# Altium project NewDriver.PrjPCB
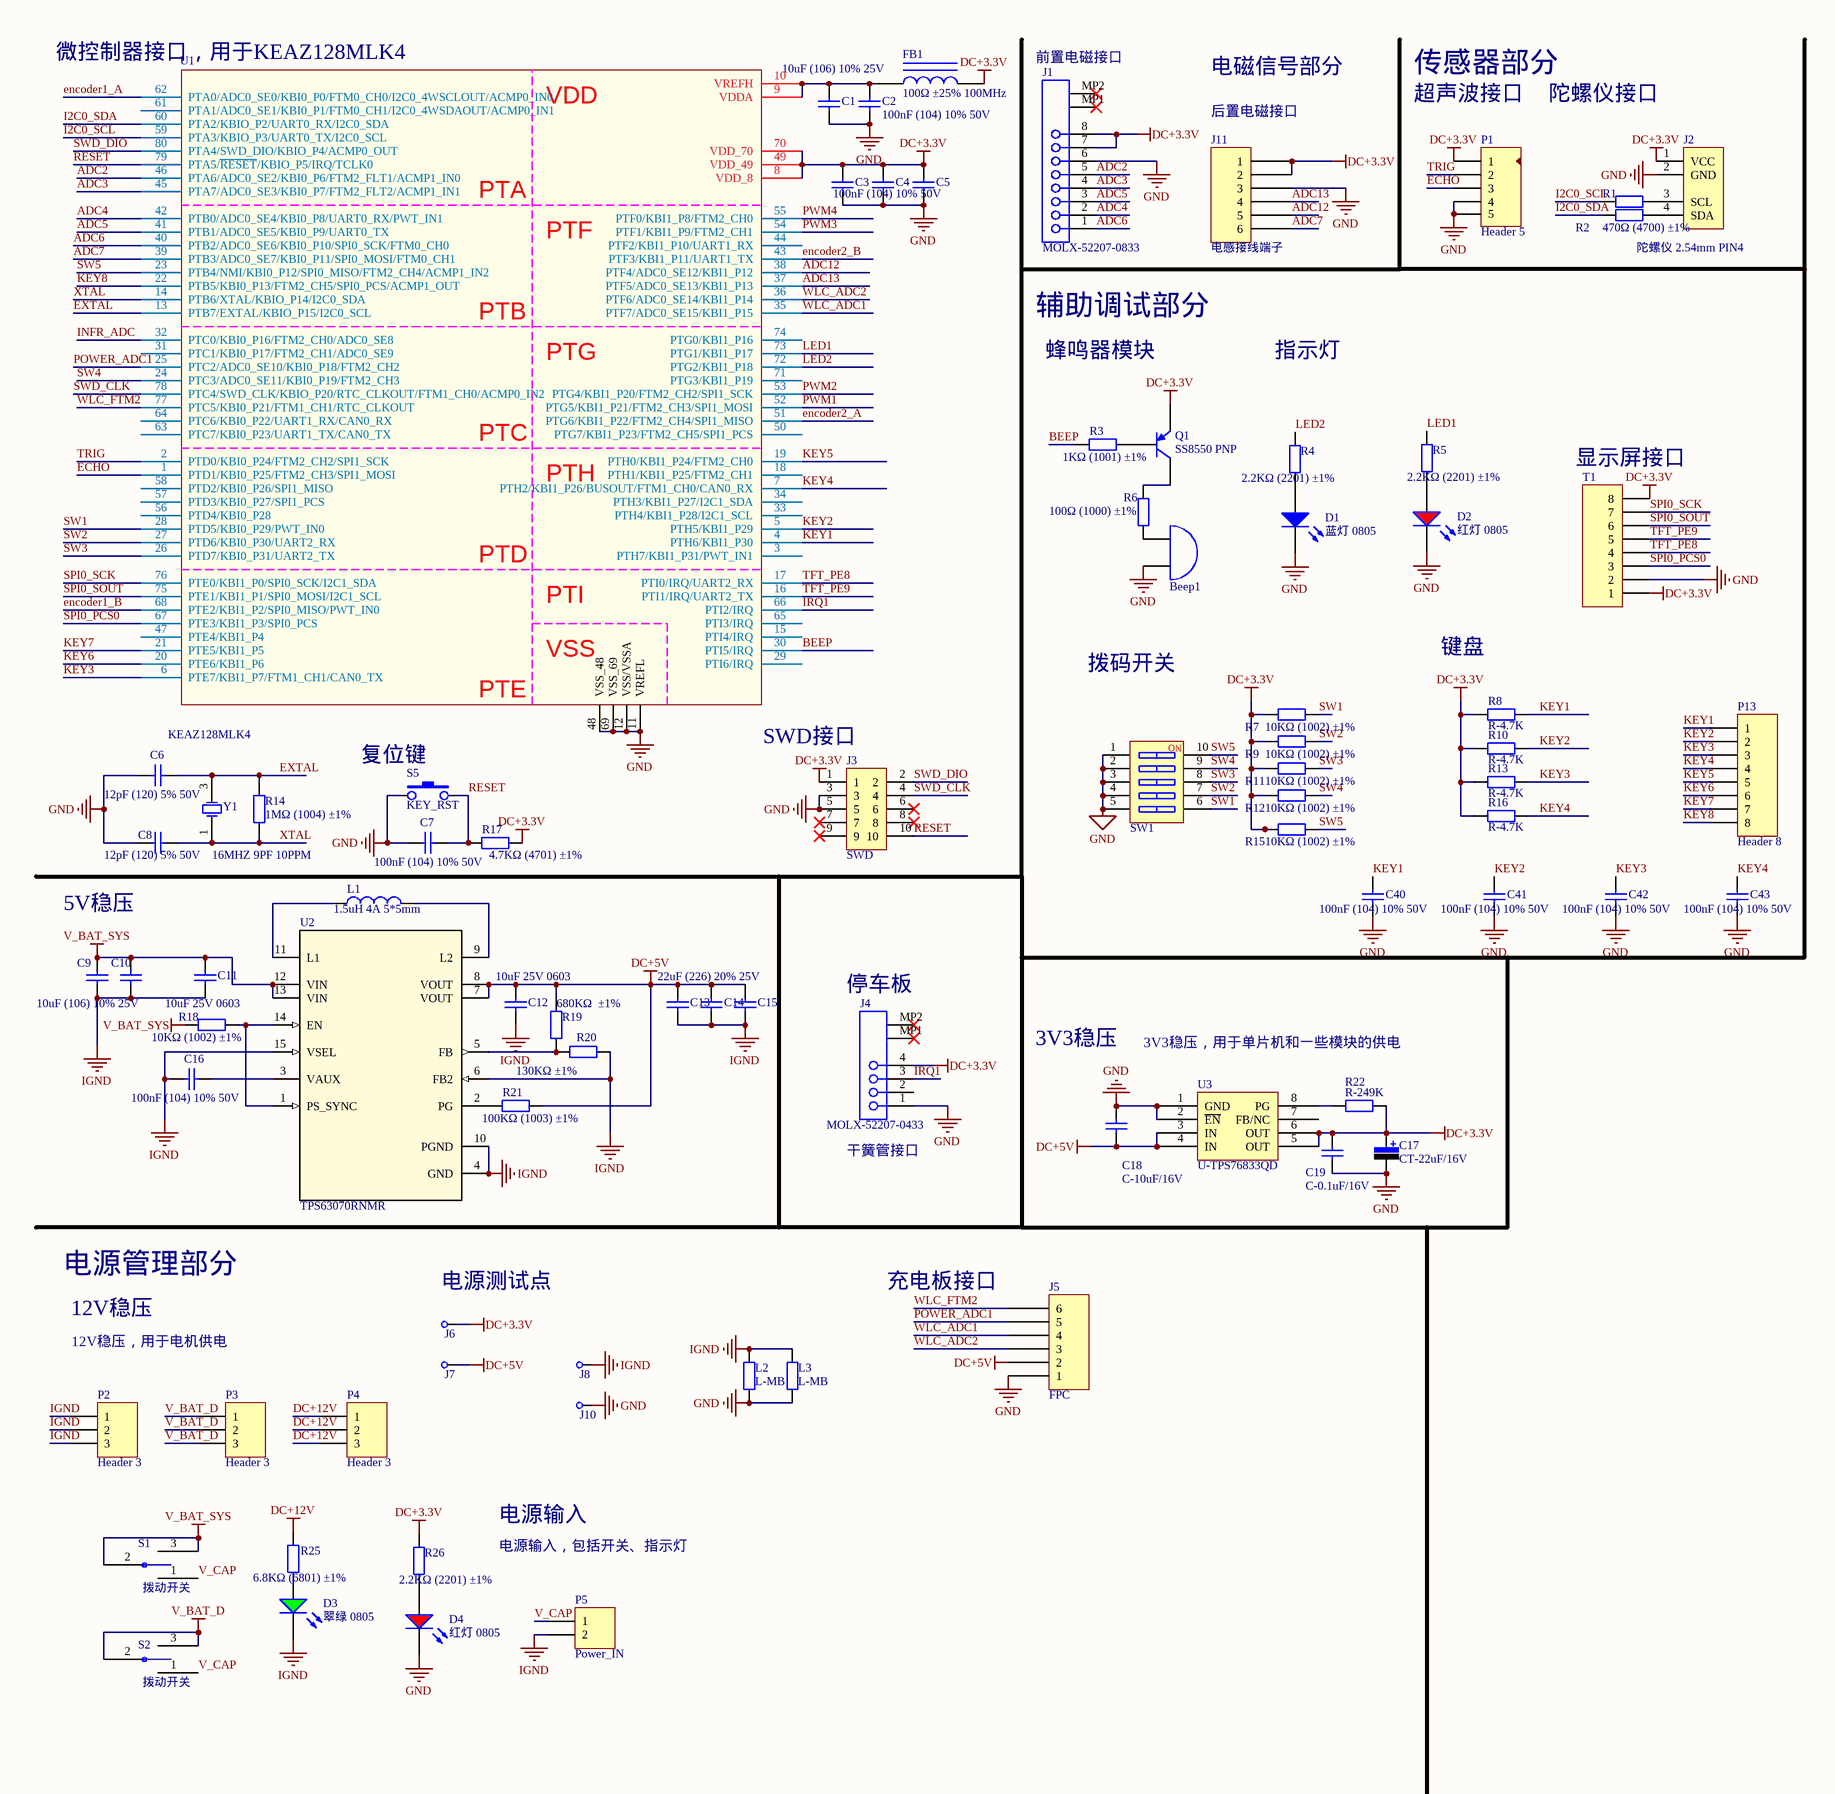
[diagram p0: thelast.SchDoc, left]
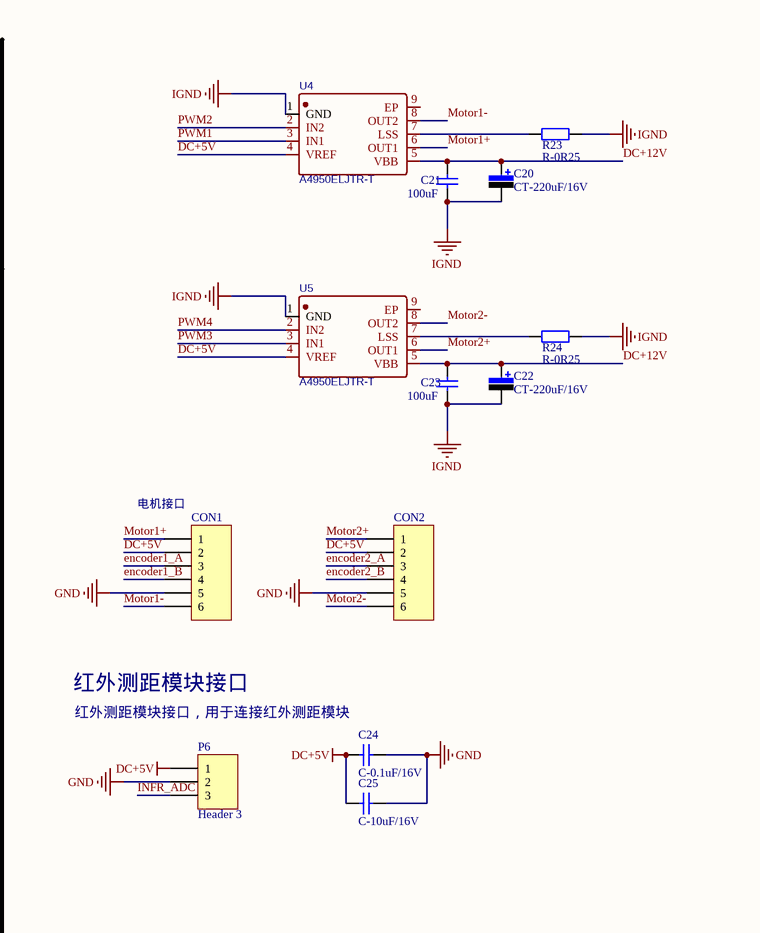
[diagram p1: thelast.SchDoc, right]
1 sheet, 95 parts. Net scope: global (net labels, ports and power ports of the same name join across sheets).
Board file: NewDriver.PcbDoc

## Sheet thelast.SchDoc
size A2

### Parts
Beep1  蜂鸣器  [beep]  (value not drawn)
C1  10uF (106) 10% 25V  [0603_C]
C2  100nF (104) 10% 50V  [0603_C]
C3  100nF (104) 10% 50V  [0603-1]
C4  100nF (104) 10% 50V  [0603-1]  (value not drawn)
C5  100nF (104) 10% 50V  [0603-1]  (value not drawn)
C6  12pF (120) 5% 50V  [0603-1]
C7  100nF (104) 10% 50V  [0603-1]
C8  12pF (120) 5% 50V  [0603-1]
C9  10uF (106) 10% 25V  [0805_C]
C10  10uF (106) 10% 25V  [0805_C]  (value not drawn)
C11  10uF 25V 0603  [0603_C]
C12  10uF 25V 0603  [0603_C]
C13  22uF (226) 20% 25V  [0805_C]  (value not drawn)
C14  22uF (226) 20% 25V  [0805_C]  (value not drawn)
C15  22uF (226) 20% 25V  [0805_C]
C16  100nF (104) 10% 50V  [0603_C]
C17  CT-22uF/16V  [CAP-3528]
C18  C-10uF/16V  [0603-1]
C19  C-0.1uF/16V  [0603-1]
C20  CT-220uF/16V  [CASE-E_7343]
C21  100uF  [0603-1]
C22  CT-220uF/16V  [CASE-E_7343]
C23  100uF  [0603-1]
C24  C-0.1uF/16V  [0603-1]
C25  C-10uF/16V  [0603-1]
C40  100nF (104) 10% 50V  [0603-1]
C41  100nF (104) 10% 50V  [0603-1]
C42  100nF (104) 10% 50V  [0603-1]
C43  100nF (104) 10% 50V  [0603-1]
CON1  Header 6  [HDR1X6]  (value not drawn)
CON2  Header 6  [HDR1X6]  (value not drawn)
D1  蓝灯 0805  [0603_R]
D2  红灯 0805  [0603_R]
D3  翠绿 0805  [0603_R]
D4  红灯 0805  [0603_R]
FB1  100Ω ±25% 100MHz  [0805-1]
J1  MOLX-52207-0833  [FPC-SMD_8PIN-PITCH1.00-BR_LW10251-08]
J2  陀螺仪 2.54mm PIN4  [2.54排针1X4]
J3  SWD  [2.54排针2X5]
J4  MOLX-52207-0433  [MOLX-52207-0433]
J5  FPC  [FPC6P]
J6  CHECK  [CHECK-A]  (value not drawn)
J7  CHECK  [CHECK-A]  (value not drawn)
J8  CHECK  [CHECK-A]  (value not drawn)
J10  CHECK  [CHECK-A]  (value not drawn)
J11  电感接线端子  [FPC6P]
L1  1.5uH 4A 5*5mm  [Inductor_1.5uH]
L2  L-MB  [0603-1]
L3  L-MB  [0603-1]
P1  Header 5  [HDR5X1-2.54]
P2  Header 3  [HDR1X3]
P3  Header 3  [HDR1X3]
P4  Header 3  [HDR1X3]
P5  Power_IN  [电源接口]
P6  Header 3  [HDR1X3]
P13  Header 8  [HDR1X8]
Q1  SS8550 PNP  [SOT-23Q]
R1  470Ω (4700) ±1%  [0603_R]  (value not drawn)
R2  470Ω (4700) ±1%  [0603_R]
R3  1KΩ (1001) ±1%  [0603_R]
R4  2.2KΩ (2201) ±1%  [0603_R]
R5  2.2KΩ (2201) ±1%  [0603_R]
R6  100Ω (1000) ±1%  [0603_R]
R7  10KΩ (1002) ±1%  [0603_R]
R8  R-4.7K  [0603-1]
R9  10KΩ (1002) ±1%  [0603_R]
R10  R-4.7K  [0603-1]
R11  10KΩ (1002) ±1%  [0603_R]
R12  10KΩ (1002) ±1%  [0603_R]
R13  R-4.7K  [0603-1]
R14  1MΩ (1004) ±1%  [0603_R]
R15  10KΩ (1002) ±1%  [0603_R]
R16  R-4.7K  [0603-1]
R17  4.7KΩ (4701) ±1%  [0603_R]
R18  10KΩ (1002) ±1%  [0603_R]
R19  680KΩ  ±1%  [0603_R]
R20  130KΩ ±1%  [0603_R]
R21  100KΩ (1003) ±1%  [0603_R]
R22  R-249K  [0603-1]
R23  R-0R25  [2512]
R24  R-0R25  [2512]
R25  6.8KΩ (6801) ±1%  [0603_R]
R26  2.2KΩ (2201) ±1%  [0603_R]
S1  拨动开关  [SW-TO3]
S2  拨动开关  [SW-TO3]
S5  KEY_RST  [KEY-K2]
SW1  5P  [拨码开关DIP-5P]  (value not drawn)
T1  Header 8  [HDR1X8]  (value not drawn)
U1  KEAZ128MLK4  [LQFP80(KEA)]
U2  TPS63070RNMR  [RNM0015A]
U3  U-TPS76833QD  [SOIC-8-r]
U4  A4950ELJTR-T  [SOIC-8_EP_150MIL]
U5  A4950ELJTR-T  [SOIC-8_EP_150MIL]
Y1  16MHZ 9PF 10PPM  [SMD-3225_4P]

### Nets
DC+3.3V: C3.2 C4.2 C5.2 C17.1 C19.2 FB1.2 J1.7 J1.8 J2.1(VCC) J3.1 J4.4 J6.1 J11.1 J11.2 P1.1 Q1.E R7.1 R8.1 R9.1 R10.1 R11.1 R12.1 R13.1 R15.1 R16.1 R17.1 R22.2 R26.2 T1.1 T1.8 U1.8(VDD_8) U1.49(VDD_49) U1.70(VDD_70) U3.5(OUT) U3.6(OUT)
DC+5V: C12.1 C13.2 C14.2 C15.2 C18.1 C24.1 C25.2 CON1.2 CON2.2 J5.2 J7.1 P6.1 R19.2 R21.2 U2.7(VOUT) U2.8(VOUT) U3.3(IN) U3.4(IN) U4.4(VREF) U5.4(VREF)
DC+12V: C20.1 C21.2 C22.1 C23.2 P4.1 P4.2 P4.3 R25.2 U4.5(VBB) U5.5(VBB)
GND: Beep1.2(B) C1.1 C2.1 C3.1 C4.1 C5.1 C6.1 C7.1 C8.1 C17.2 C18.2 C19.1 C24.2 C25.1 C40.2 C41.2 C42.2 C43.2 CON1.5 CON2.5 D1.K D2.K D4.K J1.6 J2.2(GND) J3.3 J3.5 J4.1 J5.1 J10.1 J11.3 L2.1 L3.1 P1.4 P1.5 P6.2 S5.1 SW1.1 SW1.2 SW1.3 SW1.4 SW1.5 T1.2 U1.11(VREFL) U1.12(VSS/VSSA) U1.48(VSS_48) U1.69(VSS_69) U3.1(GND) U3.2(~{EN})
IGND: C9.1 C10.1 C11.1 C12.2 C13.1 C14.1 C15.1 C16.1 C20.2 C21.1 C22.2 C23.1 D3.K J8.1 L2.2 L3.2 P2.1 P2.2 P2.3 P5.2 R20.1 R23.1 R24.1 U2.4(GND) U2.6(FB2) U2.10(PGND) U2.15(VSEL) U4.1(GND) U5.1(GND)
V_BAT_D: P3.1 P3.2 P3.3 S2.2 S2.3
V_BAT_SYS: C9.2 C10.2 C11.2 R18.2 S1.2 S1.3 U2.12(VIN) U2.13(VIN)
ADC2: J1.5 U1.46(PTA6/ADC0_SE2/KBI0_P6/FTM2_FLT1/ACMP1_IN0)
ADC3: J1.4 U1.45(PTA7/ADC0_SE3/KBI0_P7/FTM2_FLT2/ACMP1_IN1)
ADC4: J1.2 U1.42(PTB0/ADC0_SE4/KBI0_P8/UART0_RX/PWT_IN1)
ADC5: J1.3 U1.41(PTB1/ADC0_SE5/KBI0_P9/UART0_TX)
ADC6: J1.1 U1.40(PTB2/ADC0_SE6/KBI0_P10/SPI0_SCK/FTM0_CH0)
ADC7: J11.6 U1.39(PTB3/ADC0_SE7/KBI0_P11/SPI0_MOSI/FTM0_CH1)
ADC12: J11.5 U1.38(PTF4/ADC0_SE12/KBI1_P12)
ADC13: J11.4 U1.37(PTF5/ADC0_SE13/KBI1_P13)
BEEP: R3.1 U1.30(PTI5/IRQ)
ECHO: P1.3 U1.1(PTD1/KBI0_P25/FTM2_CH3/SPI1_MOSI)
encoder1_A: CON1.3 U1.62(PTA0/ADC0_SE0/KBI0_P0/FTM0_CH0/I2C0_4WSCLOUT/ACMP0_IN0)
encoder1_B: CON1.4 U1.68(PTE2/KBI1_P2/SPI0_MISO/PWT_IN0)
encoder2_A: CON2.3 U1.51(PTG6/KBI1_P22/FTM2_CH4/SPI1_MISO)
encoder2_B: CON2.4 U1.43(PTF3/KBI1_P11/UART1_TX)
EXTAL: C6.2 R14.2 U1.13(PTB7/EXTAL/KBIO_P15/I2C0_SCL) Y1.3(OSC2)
I2C0_SCL: R1.1 U1.59(PTA3/KBIO_P3/UART0_TX/I2C0_SCL)
I2C0_SDA: R2.1 U1.60(PTA2/KBIO_P2/UART0_RX/I2C0_SDA)
INFR_ADC: P6.3 U1.32(PTC0/KBI0_P16/FTM2_CH0/ADC0_SE8)
IRQ1: J4.3 U1.66(PTI2/IRQ)
KEY1: C40.1 P13.1 R8.2 U1.4(PTH6/KBI1_P30)
KEY2: C41.1 P13.2 R10.2 U1.5(PTH5/KBI1_P29)
KEY3: C42.1 P13.3 R13.2 U1.6(PTE7/KBI1_P7/FTM1_CH1/CAN0_TX)
KEY4: C43.1 P13.4 R16.2 U1.7(PTH2/KBI1_P26/BUSOUT/FTM1_CH0/CAN0_RX)
KEY5: P13.5 U1.19(PTH0/KBI1_P24/FTM2_CH0)
KEY6: P13.6 U1.20(PTE6/KBI1_P6)
KEY7: P13.7 U1.21(PTE5/KBI1_P5)
KEY8: P13.8 U1.22(PTB5/KBI0_P13/FTM2_CH5/SPI0_PCS/ACMP1_OUT)
LED1: R5.2 U1.73(PTG1/KBI1_P17)
LED2: R4.2 U1.72(PTG2/KBI1_P18)
Motor1+: CON1.1 U4.6(OUT1)
Motor1-: CON1.6 U4.8(OUT2)
Motor2+: CON2.1 U5.6(OUT1)
Motor2-: CON2.6 U5.8(OUT2)
POWER_ADC1: J5.5 U1.25(PTC2/ADC0_SE10/KBI0_P18/FTM2_CH2)
PWM1: U1.52(PTG5/KBI1_P21/FTM2_CH3/SPI1_MOSI) U4.3(IN1)
PWM2: U1.53(PTG4/KBI1_P20/FTM2_CH2/SPI1_SCK) U4.2(IN2)
PWM3: U1.54(PTF1/KBI1_P9/FTM2_CH1) U5.3(IN1)
PWM4: U1.55(PTF0/KBI1_P8/FTM2_CH0) U5.2(IN2)
RESET: C7.2 J3.10 R17.2 S5.2 U1.79(PTA5/~{RESET}/KBIO_P5/IRQ/TCLK0)
SPI0_PCS0: T1.3 U1.67(PTE3/KBI1_P3/SPI0_PCS)
SPI0_SCK: T1.7 U1.76(PTE0/KBI1_P0/SPI0_SCK/I2C1_SDA)
SPI0_SOUT: T1.6 U1.75(PTE1/KBI1_P1/SPI0_MOSI/I2C1_SCL)
SW1: R7.2 SW1.6 U1.28(PTD5/KBI0_P29/PWT_IN0)
SW2: R9.2 SW1.7 U1.27(PTD6/KBI0_P30/UART2_RX)
SW3: R11.2 SW1.8 U1.26(PTD7/KBI0_P31/UART2_TX)
SW4: R12.2 SW1.9 U1.24(PTC3/ADC0_SE11/KBI0_P19/FTM2_CH3)
SW5: R15.2 SW1.10 U1.23(PTB4/NMI/KBI0_P12/SPI0_MISO/FTM2_CH4/ACMP1_IN2)
SWD_CLK: J3.4 U1.78(PTC4/SWD_CLK/KBIO_P20/RTC_CLKOUT/FTM1_CH0/ACMP0_IN2)
SWD_DIO: J3.2 U1.80(PTA4/SWD_DIO/KBIO_P4/ACMP0_OUT)
TFT_PE8: T1.4 U1.17(PTI0/IRQ/UART2_RX)
TFT_PE9: T1.5 U1.16(PTI1/IRQ/UART2_TX)
TRIG: P1.2 U1.2(PTD0/KBI0_P24/FTM2_CH2/SPI1_SCK)
V_CAP: P5.1 S1.1 S2.1
WLC_ADC1: J5.4 U1.35(PTF7/ADC0_SE15/KBI1_P15)
WLC_ADC2: J5.3 U1.36(PTF6/ADC0_SE14/KBI1_P14)
WLC_FTM2: J5.6 U1.77(PTC5/KBI0_P21/FTM1_CH1/RTC_CLKOUT)
XTAL: C8.2 R14.1 U1.14(PTB6/XTAL/KBIO_P14/I2C0_SDA) Y1.1(OSC1)
NetBeep1_1: Beep1.1(A) R6.1
NetC1_2: C1.2 C2.2 FB1.1 U1.9(VDDA) U1.10(VREFH)
NetC16_2: C16.2 U2.3(VAUX)
NetD1_A: D1.A R4.1
NetD2_A: D2.A R5.1
NetD3_A: D3.A R25.1
NetD4_A: D4.A R26.1
NetJ2_3: J2.3(SCL) R1.2
NetJ2_4: J2.4(SDA) R2.2
NetL1_1: L1.1 U2.11(L1)
NetL1_2: L1.2 U2.9(L2)
NetQ1_B: Q1.B R3.2
NetQ1_C: Q1.C R6.2
NetR18_1: R18.1 U2.1(PS_SYNC) U2.14(EN)
NetR19_1: R19.1 R20.2 U2.5(FB)
NetR21_1: R21.1 U2.2(PG)
NetR22_1: R22.1 U3.8(PG)
NetR23_2: R23.2 U4.7(LSS)
NetR24_2: R24.2 U5.7(LSS)

Not connected (* = marked no-connect by the designer): J1 MP1* MP2*; J3 6* 7* 8* 9*; J4 2 MP1* MP2*; U1 3(PTH7/KBI1_P31/PWT_IN1) 15(PTI4/IRQ) 18(PTH1/KBI1_P25/FTM2_CH1) 29(PTI6/IRQ) 31(PTC1/KBI0_P17/FTM2_CH1/ADC0_SE9) 33(PTH4/KBI1_P28/I2C1_SCL) 34(PTH3/KBI1_P27/I2C1_SDA) 44(PTF2/KBI1_P10/UART1_RX) 47(PTE4/KBI1_P4) 50(PTG7/KBI1_P23/FTM2_CH5/SPI1_PCS) 56(PTD4/KBI0_P28) 57(PTD3/KBI0_P27/SPI1_PCS) 58(PTD2/KBI0_P26/SPI1_MISO) 61(PTA1/ADC0_SE1/KBI0_P1/FTM0_CH1/I2C0_4WSDAOUT/ACMP0_IN1) 63(PTC7/KBI0_P23/UART1_TX/CAN0_TX) 64(PTC6/KBI0_P22/UART1_RX/CAN0_RX) 65(PTI3/IRQ) 71(PTG3/KBI1_P19) 74(PTG0/KBI1_P16); U3 7(FB/NC); U4 9(EP); U5 9(EP)

### Notes on the sheet
- (near U1) 微控制器接口，用于KEAZ128MLK4
- (near J1) 前置电磁接口
- (near J11) 后置电磁接口
- 电磁信号部分
- 传感器部分
- 超声波接口
- 陀螺仪接口
- 辅助调试部分
- 蜂鸣器模块
- 指示灯
- (near T1) 显示屏接口
- (near CON1) 电机接口
- 键盘
- 拨码开关
- 红外测距模块接口
- (near P6) 红外测距模块接口，用于连接红外测距模块
- 复位键
- (near U1) SWD接口
- 5V稳压
- (near J4) 停车板
- 3V3稳压
- 3V3稳压，用于单片机和一些模块的供电
- (near J4) 干簧管接口
- 电源管理部分
- 12V稳压
- (near J6) 电源测试点
- 充电板接口
- 12V稳压，用于电机供电
- 电源输入
- 电源输入，包括开关、指示灯
- (in symbol KEAZ128MLK4) VDD; PTA; PTF; PTB; PTG; PTC; PTH; PTD; PTI; VSS; PTE
- (in symbol 拨码开关5P) NO

### Library data of the parts
C1 C9 C10 = 0805 10uF (106) 10% 25V: 贴片电容; ComponentLink1Description: 供应商链接; ComponentLink1URL: http://www.szlcsc.com/product/details_16532.html; Package: 0805; Supplier: LC; SuppliersPartNumber: C15850
C2-C5 C7 C16 C40-C43 = 0603 100nF (104) 10% 50V: 贴片电容; ComponentLink1Description: 供应商链接; ComponentLink1URL: http://www.szlcsc.com/product/details_15331.html; Package: 0603; Supplier: LC; SuppliersPartNumber: C14663
C6 C8 = 0603 12pF (120) 5% 50V: 贴片电容; ComponentLink1Description: 供应商链接; ComponentLink1URL: http://www.szlcsc.com/product/details_39506.html; Package: 0603; Supplier: LC; SuppliersPartNumber: C38523
C11 C12 = 0603 10uF (106) 10% 10V: 贴片电容; ComponentLink1Description: 供应商链接; ComponentLink1URL: http://www.szlcsc.com/product/details_20411.html; Package: 0603; Supplier: LC; SuppliersPartNumber: C19702
C13-C15 = 0805 22uF (226) 20% 25V: 贴片电容; ComponentLink1Description: 供应商链接; ComponentLink1URL: http://www.szlcsc.com/product/details_46786.html; Package: 0805; Supplier: LC; SuppliersPartNumber: C45783
C17 C20 C22 = Cap-Pol-A: 钽电容; Published: 8-Jun-2000; LatestRevisionDate: 17-Jul-2002; LatestRevisionNote: Re-released for DXP Platform.; PackageReference: RB7.6-15; Publisher: Altium Limited; Comment_1: Cap-Pol
C18 = Cap: Capacitor; Value: 0.1uF; Published: 8-Jun-2000; LatestRevisionDate: 17-Jul-2002; LatestRevisionNote: Re-released for DXP Platform.; PackageReference: RAD-0.3; Publisher: Altium Limited; PackageDescription: Radial Cap, Thru-Hole; 2 Leads; 0.3 in Pin Spacing
C19 C21 C23 = Cap: Capacitor; Value: 100nF; Published: 8-Jun-2000; LatestRevisionDate: 17-Jul-2002; LatestRevisionNote: Re-released for DXP Platform.; PackageReference: RAD-0.3; Publisher: Altium Limited; PackageDescription: Radial Cap, Thru-Hole; 2 Leads; 0.3 in Pin Spacing
C24 C25 = Cap: Capacitor; Value: 100pF; Published: 8-Jun-2000; LatestRevisionDate: 17-Jul-2002; LatestRevisionNote: Re-released for DXP Platform.; PackageReference: RAD-0.3; Publisher: Altium Limited; PackageDescription: Radial Cap, Thru-Hole; 2 Leads; 0.3 in Pin Spacing
CON1 CON2 = Header 6: Header, 6-Pin; LatestRevisionDate: 17-Jul-2002; LatestRevisionNote: Re-released for DXP Platform.; Publisher: Altium Limited; Price(RMB): 0.00
D1 = 0805 蓝灯: 发光二极管; ComponentLink1Description: 供应商链接; ComponentLink1URL: http://www.szlcsc.com/product/details_2666.html; Package: 0805; Supplier: LC; SuppliersPartNumber: C2293
D2 D4 = 0805 红灯: 发光二极管; ComponentLink1Description: 供应商链接; ComponentLink1URL: http://www.szlcsc.com/product/details_2668.html; Package: 0805; Supplier: LC; SuppliersPartNumber: C2295
D3 = 0805 翠绿: 发光二极管; ComponentLink1Description: 供应商链接; ComponentLink1URL: http://www.szlcsc.com/product/details_2670.html; Package: 0805; Supplier: LC; SuppliersPartNumber: C2297
FB1 = 0805 100Ω 25% 100MHz: 贴片磁珠; ComponentLink1Description: 供应商链接; ComponentLink1URL: http://www.szlcsc.com/product/details_1367.html; Package: 0805; Supplier: LC; SuppliersPartNumber: C1015
J1 = MOLX-52207-0833: 1.0 mm Pitch Easy-On(TM) Type FPC Connector, 2.7 mm Mated Height, Right Angle, ZIF, SMT, Top Contact, 8 Circuits, -40 to 85 degC, ELV and RoHS Compliant, Tape and Reel; Manufacturer: Molex; Circuits (Loaded): 8; Current (Max per Contact): 1A; Durability (mating cycles max): 30; Entry Angle: 90degrees Angle; Mated Height: 2.70mm; Material - Metal: Phosphor Bronze; Material - Plating Mating: Silver, Tin-Bismuth; PCB Locator: No; PCB Retention: Yes; Pitch - Mating Interface: 1.00mm; Voltage (Max): 125V; PackageVersion: Rev. B, 08/2013; PackageReference: 52207-0833; PackageDescription: 8-Lead FPC Connector, Pitch 1.0 mm; Supplier 1: Farnell; Supplier Part Number 1: 2361329; Supplier 2: Farnell; Supplier Part Number 2: 2361290; Supplier 3: Mouser; Supplier Part Number 3: 538-52207-0833; Contact Position: Top; Material - Plating Termination: Silver, Tin-Bismuth; Number of Rows: 1; Orientation: Right Angle; Packing: Tape and Reel; Pitch - Termination Interface: 1.00mm; Polarized to PCB: Yes; RoHS: TRUE; Stackable: No; Mounting Technology: Surface Mount; PartNumber: 52207-0833; ComponentLink1Description: Manufacturer URL; ComponentLink1URL: http://www.molex.com/molex/index.jsp; ComponentLink2Description: Datasheet; ComponentLink2URL: http://www.molex.com/webdocs/datasheets/pdf/en-us/0522070833_FFC_FPC_CONNECTORS.pdf; ComponentLink3Description: Package Specification; ComponentLink3URL: http://www.molex.com/pdm_docs/sd/522070833_sd.pdf
J3 = SWD PIN-10
J4 = MOLX-52207-0433: 1.0 mm Pitch Easy-On(TM) Type FPC Connector, 2.7 mm Mated Height, Right Angle, ZIF, SMT, Top Contact, 4 Circuits, -40 to 85 degC, ELV and RoHS Compliant, Tape and Reel; Manufacturer: Molex; Circuits (Loaded): 4; Current (Max per Contact): 1A; Durability (mating cycles max): 30; Entry Angle: 90degrees Angle; Mated Height: 2.70mm; Material - Metal: Phosphor Bronze; Material - Plating Mating: Silver, Tin-Bismuth; PCB Locator: No; PCB Retention: Yes; Pitch - Mating Interface: 1.00mm; Voltage (Max): 125V; PackageVersion: Rev. B, 08/2013; PackageReference: 52207-0433; PackageDescription: 4-Lead FPC Connector, Pitch 1.0 mm; Supplier 1: Farnell; Supplier Part Number 1: 2361288; Supplier 2: Farnell; Supplier Part Number 2: 2361327; Supplier 3: Newark; Supplier Part Number 3: 01X1268; Supplier 4: Mouser; Supplier Part Number 4: 538-52207-0433; Contact Position: Top; Material - Plating Termination: Silver, Tin-Bismuth; Number of Rows: 1; Orientation: Right Angle; Packing: Tape and Reel; Pitch - Termination Interface: 1.00mm; Polarized to PCB: Yes; RoHS: TRUE; Stackable: No; Mounting Technology: Surface Mount; PartNumber: 52207-0433; ComponentLink1Description: Manufacturer URL; ComponentLink1URL: http://www.molex.com/molex/index.jsp; ComponentLink2Description: Datasheet; ComponentLink2URL: http://www.molex.com/webdocs/datasheets/pdf/en-us/0522070433_FFC_FPC_CONNECTORS.pdf; ComponentLink3Description: Package Specification; ComponentLink3URL: http://www.molex.com/pdm_docs/sd/522070433_sd.pdf
J5 J11 = FFC6: pin to pad: 1>6 2>5 3>4 4>3 5>2 6>1
J6-J8 J10 = CHECK: 测试点
L1 = 贴片电感
L2 L3 = Res2: Resistor; Published: 8-Jun-2000; LatestRevisionDate: 17-Jul-2002; LatestRevisionNote: Re-released for DXP Platform.; PackageReference: AXIAL-0.4; Publisher: Altium Limited
P1 = Header 5: 接插件; LatestRevisionDate: 17-Jul-2002; LatestRevisionNote: Re-released for DXP Platform.; Publisher: Altium Limited
P2-P4 P6 = Header 3: Header, 3-Pin; LatestRevisionDate: 17-Jul-2002; LatestRevisionNote: Re-released for DXP Platform.; Publisher: Altium Limited
P5 = Header 2: Header, 2-Pin; LatestRevisionDate: 17-Jul-2002; LatestRevisionNote: Re-released for DXP Platform.; Publisher: Altium Limited
P13 T1 = Header 8: Header, 8-Pin; LatestRevisionDate: 17-Jul-2002; LatestRevisionNote: Re-released for DXP Platform.; Publisher: Altium Limited
  T1: Price(RMB): 0.00
Q1 = PNP_1
R1 R2 = 0603 470Ω (4700) 1%: 贴片电阻; ComponentLink1Description: 供应商链接; ComponentLink1URL: http://www.szlcsc.com/product/details_23906.html; Package: 0603; Supplier: LC; SuppliersPartNumber: C23179
R3 = 0603 1KΩ (1001) 1%: 贴片电阻; ComponentLink1Description: 供应商链接; ComponentLink1URL: http://www.szlcsc.com/product/details_21904.html; Package: 0603; Supplier: LC; SuppliersPartNumber: C21190
R4 R25 = 0603 3.3KΩ (3301) 1%: 贴片电阻; ComponentLink1Description: 供应商链接; ComponentLink1URL: http://www.szlcsc.com/product/details_23705.html; Package: 0603; Supplier: LC; SuppliersPartNumber: C22978
R5 R26 = 0603 2.2KΩ (2201) 1%: 贴片电阻; ComponentLink1Description: 供应商链接; ComponentLink1URL: http://www.szlcsc.com/product/details_4597.html; Package: 0603; Supplier: LC; SuppliersPartNumber: C4190
R6 = 0603 100Ω (1000) 1%: 贴片电阻; ComponentLink1Description: 供应商链接; ComponentLink1URL: http://www.szlcsc.com/product/details_23502.html; Package: 0603; Supplier: LC; SuppliersPartNumber: C22775
R7 R9 R11 R12 R15 R18 = 0603 10KΩ (1002) 1%: 贴片电阻; ComponentLink1Description: 供应商链接; ComponentLink1URL: http://www.szlcsc.com/product/details_26547.html; Package: 0603; Supplier: LC; SuppliersPartNumber: C25804
R8 R10 R13 R16 = Res2: Resistor; Value: 10K; Published: 8-Jun-2000; LatestRevisionDate: 17-Jul-2002; LatestRevisionNote: Re-released for DXP Platform.; PackageReference: AXIAL-0.4; Publisher: Altium Limited
R14 = 0603 1MΩ (1004) 1%: 贴片电阻; ComponentLink1Description: 供应商链接; ComponentLink1URL: http://www.szlcsc.com/product/details_23662.html; Package: 0603; Supplier: LC; SuppliersPartNumber: C22935
R17 = 0603 4.7KΩ (4701) 1%: 贴片电阻; ComponentLink1Description: 供应商链接; ComponentLink1URL: http://www.szlcsc.com/product/details_23889.html; Package: 0603; Supplier: LC; SuppliersPartNumber: C23162
R19 = 0603 330KΩ (3303) 1%: 贴片电阻; ComponentLink1Description: 供应商链接; ComponentLink1URL: http://www.szlcsc.com/product/details_23864.html; Package: 0603; Supplier: LC; SuppliersPartNumber: C23137
R20 = 0603 51KΩ (5102) 1%: 贴片电阻; ComponentLink1Description: 供应商链接; ComponentLink1URL: http://www.szlcsc.com/product/details_23923.html; Package: 0603; Supplier: LC; SuppliersPartNumber: C23196
R21 = 0603 100KΩ (1003) 1%: 贴片电阻; ComponentLink1Description: 供应商链接; ComponentLink1URL: http://www.szlcsc.com/product/details_26546.html; Package: 0603; Supplier: LC; SuppliersPartNumber: C25803
R22-R24 = Res1: 贴片电阻; Published: 8-Jun-2000; LatestRevisionDate: 17-Jul-2002; LatestRevisionNote: Re-released for DXP Platform.; PackageReference: AXIAL-0.4; Publisher: Altium Limited
S5 = SMT_SW: SMT Tactile ‎Switch
SW1 = 拨码开关5P
U2 = TPS63070RNMR: Imported; Manufacturer: Texas Instruments; PartNumber: TPS63070RNMR; RefDes: RefDes; TYPE: TYPE; Value: Value
U3 = TPS76850
U4 U5 = A4950ELJTR-T: BOM_Manufacturer: ALLEGRO; SMT Type: Extend; BOM_Supplier: LCSC; BOM_Manufacturer Part: A4950ELJTR-T; BOM_Supplier Part: C82404; BOM_LCSC Assembly: Yes; spicePre: U
Y1 = SMD-3225_4P  16MHZ 9PF 10PPM: 贴片晶振; ComponentLink1Description: 供应商链接; ComponentLink1URL: http://www.szlcsc.com/product/details_14393.html; Package: SMD-3225_4P; Supplier: LC; SuppliersPartNumber: C13738